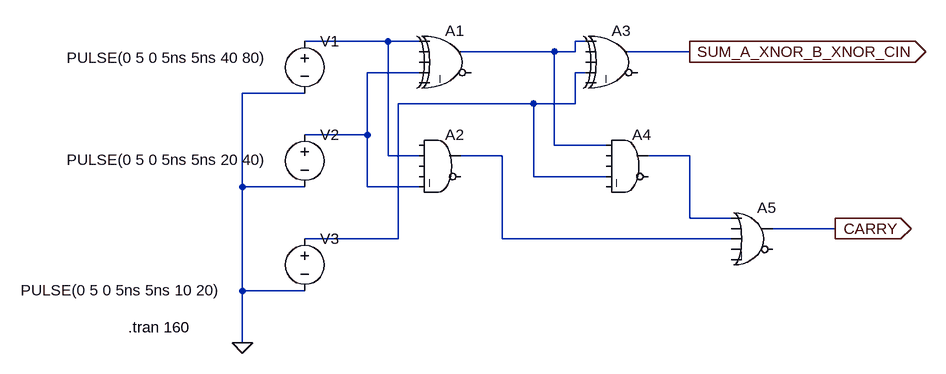
[diagram p0: schematic Full Adder.asc]
Full Adder.asc, the LTspice schematic file:
Version 4
SHEET 1 1020 680
WIRE 160 96 32 96
WIRE 208 96 160 96
WIRE 464 96 448 96
WIRE 416 112 272 112
WIRE 448 112 448 96
WIRE 448 112 416 112
WIRE 624 112 528 112
WIRE 208 144 128 144
WIRE 464 144 448 144
WIRE 32 176 -64 176
WIRE 384 192 176 192
WIRE 448 192 448 144
WIRE 448 192 384 192
WIRE 128 240 128 144
WIRE 128 240 32 240
WIRE 416 256 416 112
WIRE 496 256 416 256
WIRE 160 272 160 96
WIRE 208 272 160 272
WIRE 336 272 272 272
WIRE 624 272 560 272
WIRE 384 304 384 192
WIRE 496 304 384 304
WIRE -64 320 -64 176
WIRE 32 320 -64 320
WIRE 128 320 128 240
WIRE 208 320 128 320
WIRE 624 368 624 272
WIRE 688 368 624 368
WIRE 848 384 752 384
WIRE 176 400 176 192
WIRE 176 400 32 400
WIRE 336 400 336 272
WIRE 688 400 336 400
WIRE -64 480 -64 320
WIRE 32 480 -64 480
WIRE -64 560 -64 480
FLAG -64 560 0
FLAG 624 112 SUM_A_XNOR_B_XNOR_CIN
IOPIN 624 112 Out
FLAG 848 384 CARRY
IOPIN 848 384 Out
SYMBOL voltage 32 80 R0
WINDOW 3 -366 41 Left 2
WINDOW 123 0 0 Left 0
WINDOW 39 0 0 Left 0
SYMATTR InstName V1
SYMATTR Value PULSE(0 5 0 5ns 5ns 40 80)
SYMBOL voltage 32 224 R0
WINDOW 3 -366 54 Left 2
WINDOW 123 0 0 Left 0
WINDOW 39 0 0 Left 0
SYMATTR InstName V2
SYMATTR Value PULSE(0 5 0 5ns 5ns 20 40)
SYMBOL Digital\\xor 256 64 R0
SYMATTR InstName A1
SYMBOL Digital\\and 240 224 R0
SYMATTR InstName A2
SYMBOL Digital\\xor 512 64 R0
SYMATTR InstName A3
SYMBOL Digital\\and 528 224 R0
SYMATTR InstName A4
SYMBOL voltage 32 384 R0
WINDOW 3 -437 95 Left 2
WINDOW 123 0 0 Left 0
WINDOW 39 0 0 Left 0
SYMATTR InstName V3
SYMATTR Value PULSE(0 5 0 5ns 5ns 10 20)
SYMBOL Digital\\or 720 336 R0
SYMATTR InstName A5
TEXT -240 536 Left 2 !.tran 160

The netlist it stands for:
* Full Adder.asc
V1 N001 0 PULSE(0 5 0 5ns 5ns 40 80)
V2 N003 0 PULSE(0 5 0 5ns 5ns 20 40)
A1 N001 0 0 N003 0 0 N002 0 XOR
A2 0 N001 0 0 N003 0 N005 0 AND
A3 N002 0 0 N004 0 0 SUM_A_XNOR_B_XNOR_CIN 0 XOR
A4 N002 0 0 N004 0 0 N006 0 AND
V3 N004 0 PULSE(0 5 0 5ns 5ns 10 20)
A5 N006 0 N005 0 0 0 CARRY 0 OR
.tran 160
.backanno
.end